# Altium schematic sheet SIGNAL BLOCK DIAGRAM.SchDoc
size A1
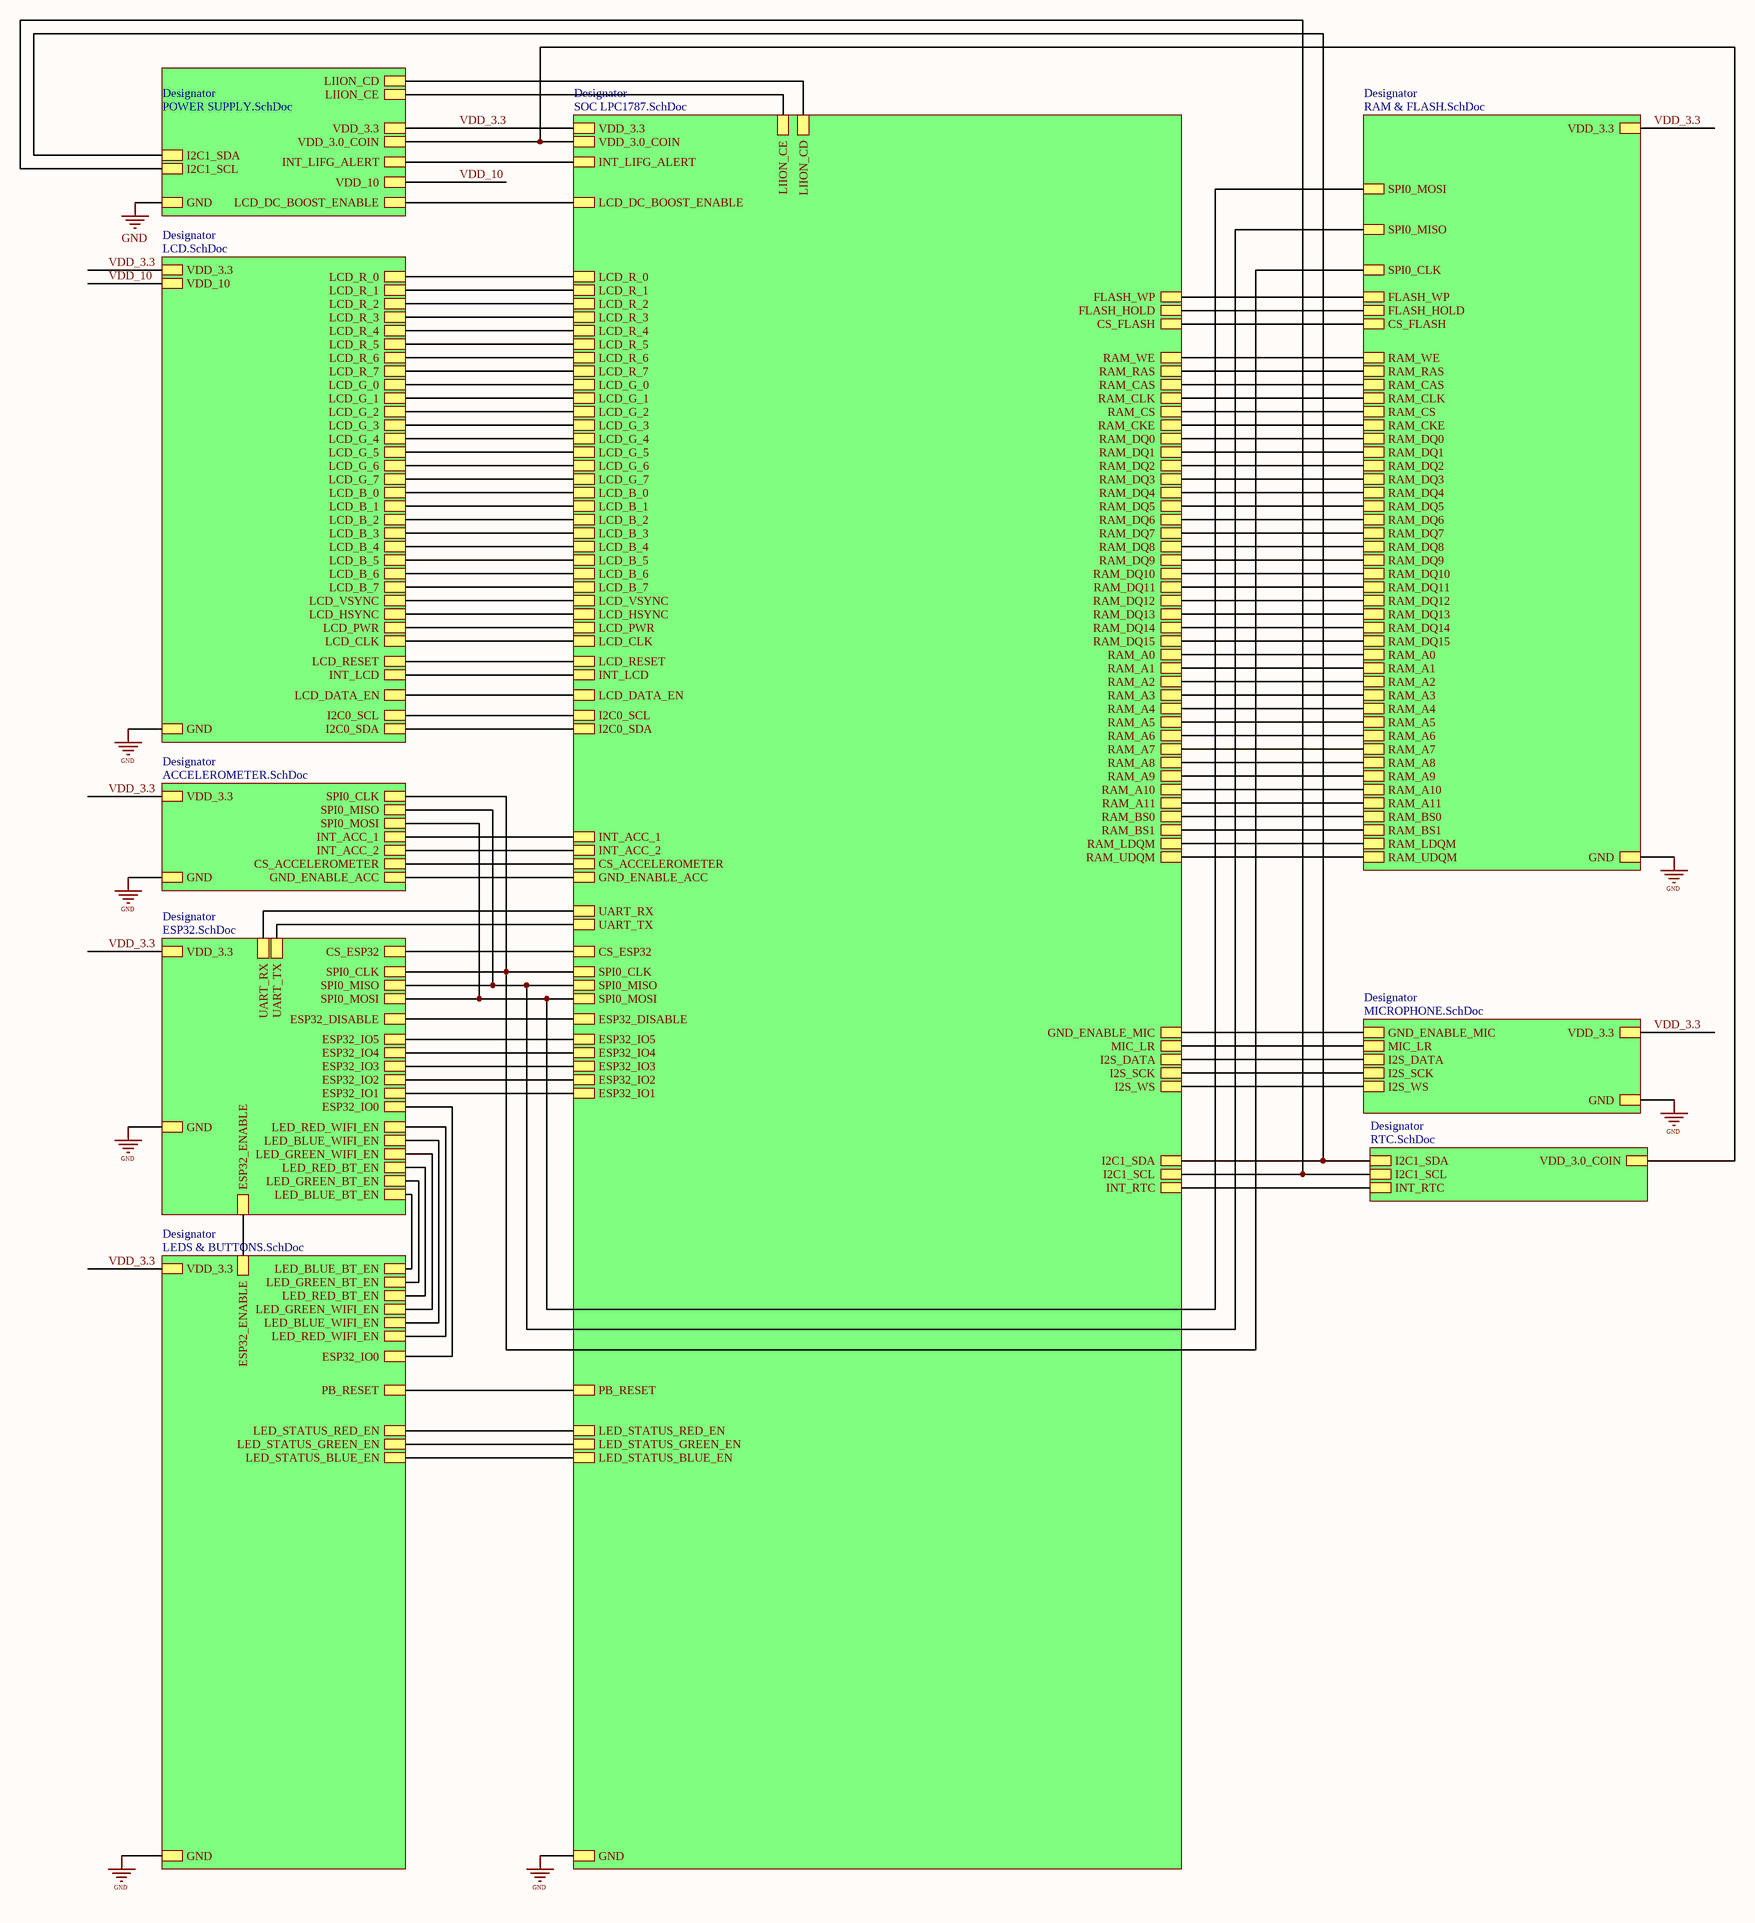
[diagram p0: SIGNAL BLOCK DIAGRAM.SchDoc]

## Sub-sheets
Designator = ACCELEROMETER.SchDoc: INT_ACC_1, GND_ENABLE_ACC, INT_ACC_2, VDD_3.3, CS_ACCELEROMETER, GND, SPI0_MISO, SPI0_CLK, SPI0_MOSI
Designator = SOC LPC1787.SchDoc: LCD_DC_BOOST_ENABLE, MIC_LR, LCD_R_2, PB_RESET, LCD_R_3, CS_FLASH, LCD_G_6, LCD_R_5, I2C1_SDA, LCD_G_0, LCD_R_0, LCD_B_2, LCD_B_1, LCD_G_2, LCD_R_1, LCD_CLK, LCD_B_4, LCD_G_4, LCD_G_5, I2C1_SCL, LCD_G_1, LCD_B_3, LCD_R_6, LCD_R_7, INT_LCD, LCD_RESET, LCD_B_0, I2C0_SDA, LCD_R_4, LCD_G_7, INT_ACC_2, INT_ACC_1, ESP32_DISABLE, LCD_G_3, CS_ESP32, CS_ACCELEROMETER, INT_RTC, VDD_3.3, GND, I2C0_SCL, LCD_DATA_EN, LCD_HSYNC, LCD_VSYNC, LCD_B_7, LCD_B_6, LCD_B_5, GND_ENABLE_ACC, LED_STATUS_GREEN_EN, LED_STATUS_RED_EN, VDD_3.0_COIN, GND_ENABLE_MIC, LED_STATUS_BLUE_EN, I2S_DATA, I2S_SCK, I2S_WS, ESP32_IO1, ESP32_IO2, ESP32_IO3, ESP32_IO4, SPI0_CLK, SPI0_MISO, SPI0_MOSI, FLASH_HOLD, FLASH_WP, LIION_CD, LIION_CE, LCD_PWR, RAM_WE, RAM_RAS, RAM_CAS, RAM_CLK, RAM_CS, RAM_CKE, RAM_DQ0, RAM_DQ1, RAM_DQ2, RAM_DQ3, RAM_DQ4, RAM_DQ5, RAM_DQ6, RAM_DQ7, RAM_DQ8, RAM_DQ9, RAM_DQ10, RAM_DQ11, RAM_DQ12, RAM_DQ13, RAM_DQ14, RAM_DQ15, RAM_A0, RAM_A1, RAM_A2, RAM_A3, RAM_A4, RAM_A5, RAM_A6, RAM_A7, RAM_A8, RAM_A9, RAM_A10, RAM_A11, RAM_BS0, RAM_BS1, RAM_LDQM, RAM_UDQM, INT_LIFG_ALERT, ESP32_IO5, UART_RX, UART_TX
Designator = LEDS & BUTTONS.SchDoc: VDD_3.3, LED_RED_BT_EN, LED_BLUE_BT_EN, LED_GREEN_BT_EN, PB_RESET, LED_RED_WIFI_EN, LED_GREEN_WIFI_EN, LED_BLUE_WIFI_EN, ESP32_IO0, ESP32_ENABLE, LED_STATUS_RED_EN, LED_STATUS_GREEN_EN, GND, LED_STATUS_BLUE_EN
Designator = RTC.SchDoc: I2C1_SDA, VDD_3.0_COIN, I2C1_SCL, INT_RTC
Designator = POWER SUPPLY.SchDoc: VDD_3.0_COIN, VDD_10, VDD_3.3, LCD_DC_BOOST_ENABLE, GND, I2C1_SDA, I2C1_SCL, LIION_CD, LIION_CE, INT_LIFG_ALERT
Designator = MICROPHONE.SchDoc: VDD_3.3, MIC_LR, GND, GND_ENABLE_MIC, I2S_WS, I2S_DATA, I2S_SCK
Designator = RAM & FLASH.SchDoc: VDD_3.3, CS_FLASH, GND, SPI0_MOSI, FLASH_HOLD, SPI0_MISO, SPI0_CLK, FLASH_WP, RAM_RAS, RAM_DQ9, RAM_WE, RAM_LDQM, RAM_CAS, RAM_DQ0, RAM_DQ1, RAM_DQ2, RAM_DQ3, RAM_CS, RAM_DQ13, RAM_DQ4, RAM_DQ15, RAM_A11, RAM_A0, RAM_A2, RAM_A3, RAM_A4, RAM_A5, RAM_A6, RAM_A7, RAM_A8, RAM_A9, RAM_DQ14, RAM_DQ10, RAM_DQ8, RAM_DQ5, RAM_DQ11, RAM_DQ6, RAM_DQ12, RAM_DQ7, RAM_A10, RAM_A1, RAM_BS1, RAM_CKE, RAM_BS0, RAM_CLK, RAM_UDQM
Designator = ESP32.SchDoc: ESP32_IO0, LED_BLUE_WIFI_EN, LED_RED_BT_EN, ESP32_DISABLE, LED_BLUE_BT_EN, LED_RED_WIFI_EN, CS_ESP32, VDD_3.3, LED_GREEN_WIFI_EN, GND, LED_GREEN_BT_EN, SPI0_MISO, SPI0_MOSI, ESP32_IO4, ESP32_IO2, SPI0_CLK, ESP32_IO1, ESP32_IO3, ESP32_IO5, UART_RX, UART_TX, ESP32_ENABLE
Designator = LCD.SchDoc: LCD_G_6, LCD_B_1, LCD_B_2, LCD_B_3, LCD_B_4, LCD_B_5, LCD_R_5, LCD_B_6, LCD_HSYNC, LCD_VSYNC, LCD_B_0, LCD_G_7, LCD_R_6, LCD_G_4, LCD_R_3, LCD_B_7, I2C0_SCL, LCD_G_0, LCD_G_5, INT_LCD, VDD_3.3, LCD_DATA_EN, LCD_R_0, LCD_R_1, LCD_R_2, LCD_RESET, I2C0_SDA, LCD_CLK, LCD_G_3, VDD_10, LCD_R_7, LCD_G_2, LCD_R_4, LCD_G_1, GND, LCD_PWR

## Nets
GND: sheet Designator/GND, sheet Designator/GND, sheet Designator/GND, sheet Designator/GND, sheet Designator/GND, sheet Designator/GND, sheet Designator/GND, sheet Designator/GND
VDD_3.3: sheet Designator/VDD_3.3, sheet Designator/VDD_3.3, sheet Designator/VDD_3.3, sheet Designator/VDD_3.3, sheet Designator/VDD_3.3, sheet Designator/VDD_3.3, sheet Designator/VDD_3.3, sheet Designator/VDD_3.3
VDD_10: sheet Designator/VDD_10, sheet Designator/VDD_10
(unnamed): sheet Designator/INT_ACC_1, sheet Designator/INT_ACC_1
(unnamed): sheet Designator/GND_ENABLE_ACC, sheet Designator/GND_ENABLE_ACC
(unnamed): sheet Designator/INT_ACC_2, sheet Designator/INT_ACC_2
(unnamed): sheet Designator/CS_ACCELEROMETER, sheet Designator/CS_ACCELEROMETER
(unnamed): sheet Designator/SPI0_MISO, sheet Designator/SPI0_MISO, sheet Designator/SPI0_MISO, sheet Designator/SPI0_MISO
(unnamed): sheet Designator/SPI0_CLK, sheet Designator/SPI0_CLK, sheet Designator/SPI0_CLK, sheet Designator/SPI0_CLK
(unnamed): sheet Designator/SPI0_MOSI, sheet Designator/SPI0_MOSI, sheet Designator/SPI0_MOSI, sheet Designator/SPI0_MOSI
(unnamed): sheet Designator/LCD_DC_BOOST_ENABLE, sheet Designator/LCD_DC_BOOST_ENABLE
(unnamed): sheet Designator/MIC_LR, sheet Designator/MIC_LR
(unnamed): sheet Designator/LCD_R_2, sheet Designator/LCD_R_2
(unnamed): sheet Designator/PB_RESET, sheet Designator/PB_RESET
(unnamed): sheet Designator/LCD_R_3, sheet Designator/LCD_R_3
(unnamed): sheet Designator/CS_FLASH, sheet Designator/CS_FLASH
(unnamed): sheet Designator/LCD_G_6, sheet Designator/LCD_G_6
(unnamed): sheet Designator/LCD_R_5, sheet Designator/LCD_R_5
(unnamed): sheet Designator/I2C1_SDA, sheet Designator/I2C1_SDA, sheet Designator/I2C1_SDA
(unnamed): sheet Designator/LCD_G_0, sheet Designator/LCD_G_0
(unnamed): sheet Designator/LCD_R_0, sheet Designator/LCD_R_0
(unnamed): sheet Designator/LCD_B_2, sheet Designator/LCD_B_2
(unnamed): sheet Designator/LCD_B_1, sheet Designator/LCD_B_1
(unnamed): sheet Designator/LCD_G_2, sheet Designator/LCD_G_2
(unnamed): sheet Designator/LCD_R_1, sheet Designator/LCD_R_1
(unnamed): sheet Designator/LCD_CLK, sheet Designator/LCD_CLK
(unnamed): sheet Designator/LCD_B_4, sheet Designator/LCD_B_4
(unnamed): sheet Designator/LCD_G_4, sheet Designator/LCD_G_4
(unnamed): sheet Designator/LCD_G_5, sheet Designator/LCD_G_5
(unnamed): sheet Designator/I2C1_SCL, sheet Designator/I2C1_SCL, sheet Designator/I2C1_SCL
(unnamed): sheet Designator/LCD_G_1, sheet Designator/LCD_G_1
(unnamed): sheet Designator/LCD_B_3, sheet Designator/LCD_B_3
(unnamed): sheet Designator/LCD_R_6, sheet Designator/LCD_R_6
(unnamed): sheet Designator/LCD_R_7, sheet Designator/LCD_R_7
(unnamed): sheet Designator/INT_LCD, sheet Designator/INT_LCD
(unnamed): sheet Designator/LCD_RESET, sheet Designator/LCD_RESET
(unnamed): sheet Designator/LCD_B_0, sheet Designator/LCD_B_0
(unnamed): sheet Designator/I2C0_SDA, sheet Designator/I2C0_SDA
(unnamed): sheet Designator/LCD_R_4, sheet Designator/LCD_R_4
(unnamed): sheet Designator/LCD_G_7, sheet Designator/LCD_G_7
(unnamed): sheet Designator/ESP32_DISABLE, sheet Designator/ESP32_DISABLE
(unnamed): sheet Designator/LCD_G_3, sheet Designator/LCD_G_3
(unnamed): sheet Designator/CS_ESP32, sheet Designator/CS_ESP32
(unnamed): sheet Designator/INT_RTC, sheet Designator/INT_RTC
(unnamed): sheet Designator/I2C0_SCL, sheet Designator/I2C0_SCL
(unnamed): sheet Designator/LCD_DATA_EN, sheet Designator/LCD_DATA_EN
(unnamed): sheet Designator/LCD_HSYNC, sheet Designator/LCD_HSYNC
(unnamed): sheet Designator/LCD_VSYNC, sheet Designator/LCD_VSYNC
(unnamed): sheet Designator/LCD_B_7, sheet Designator/LCD_B_7
(unnamed): sheet Designator/LCD_B_6, sheet Designator/LCD_B_6
(unnamed): sheet Designator/LCD_B_5, sheet Designator/LCD_B_5
(unnamed): sheet Designator/LED_STATUS_GREEN_EN, sheet Designator/LED_STATUS_GREEN_EN
(unnamed): sheet Designator/LED_STATUS_RED_EN, sheet Designator/LED_STATUS_RED_EN
(unnamed): sheet Designator/VDD_3.0_COIN, sheet Designator/VDD_3.0_COIN, sheet Designator/VDD_3.0_COIN
(unnamed): sheet Designator/GND_ENABLE_MIC, sheet Designator/GND_ENABLE_MIC
(unnamed): sheet Designator/LED_STATUS_BLUE_EN, sheet Designator/LED_STATUS_BLUE_EN
(unnamed): sheet Designator/I2S_DATA, sheet Designator/I2S_DATA
(unnamed): sheet Designator/I2S_SCK, sheet Designator/I2S_SCK
(unnamed): sheet Designator/I2S_WS, sheet Designator/I2S_WS
(unnamed): sheet Designator/ESP32_IO1, sheet Designator/ESP32_IO1
(unnamed): sheet Designator/ESP32_IO2, sheet Designator/ESP32_IO2
(unnamed): sheet Designator/ESP32_IO3, sheet Designator/ESP32_IO3
(unnamed): sheet Designator/ESP32_IO4, sheet Designator/ESP32_IO4
(unnamed): sheet Designator/FLASH_HOLD, sheet Designator/FLASH_HOLD
(unnamed): sheet Designator/FLASH_WP, sheet Designator/FLASH_WP
(unnamed): sheet Designator/LIION_CD, sheet Designator/LIION_CD
(unnamed): sheet Designator/LIION_CE, sheet Designator/LIION_CE
(unnamed): sheet Designator/LCD_PWR, sheet Designator/LCD_PWR
(unnamed): sheet Designator/RAM_WE, sheet Designator/RAM_WE
(unnamed): sheet Designator/RAM_RAS, sheet Designator/RAM_RAS
(unnamed): sheet Designator/RAM_CAS, sheet Designator/RAM_CAS
(unnamed): sheet Designator/RAM_CLK, sheet Designator/RAM_CLK
(unnamed): sheet Designator/RAM_CS, sheet Designator/RAM_CS
(unnamed): sheet Designator/RAM_CKE, sheet Designator/RAM_CKE
(unnamed): sheet Designator/RAM_DQ0, sheet Designator/RAM_DQ0
(unnamed): sheet Designator/RAM_DQ1, sheet Designator/RAM_DQ1
(unnamed): sheet Designator/RAM_DQ2, sheet Designator/RAM_DQ2
(unnamed): sheet Designator/RAM_DQ3, sheet Designator/RAM_DQ3
(unnamed): sheet Designator/RAM_DQ4, sheet Designator/RAM_DQ4
(unnamed): sheet Designator/RAM_DQ5, sheet Designator/RAM_DQ5
(unnamed): sheet Designator/RAM_DQ6, sheet Designator/RAM_DQ6
(unnamed): sheet Designator/RAM_DQ7, sheet Designator/RAM_DQ7
(unnamed): sheet Designator/RAM_DQ8, sheet Designator/RAM_DQ8
(unnamed): sheet Designator/RAM_DQ9, sheet Designator/RAM_DQ9
(unnamed): sheet Designator/RAM_DQ10, sheet Designator/RAM_DQ10
(unnamed): sheet Designator/RAM_DQ11, sheet Designator/RAM_DQ11
(unnamed): sheet Designator/RAM_DQ12, sheet Designator/RAM_DQ12
(unnamed): sheet Designator/RAM_DQ13, sheet Designator/RAM_DQ13
(unnamed): sheet Designator/RAM_DQ14, sheet Designator/RAM_DQ14
(unnamed): sheet Designator/RAM_DQ15, sheet Designator/RAM_DQ15
(unnamed): sheet Designator/RAM_A0, sheet Designator/RAM_A0
(unnamed): sheet Designator/RAM_A1, sheet Designator/RAM_A1
(unnamed): sheet Designator/RAM_A2, sheet Designator/RAM_A2
(unnamed): sheet Designator/RAM_A3, sheet Designator/RAM_A3
(unnamed): sheet Designator/RAM_A4, sheet Designator/RAM_A4
(unnamed): sheet Designator/RAM_A5, sheet Designator/RAM_A5
(unnamed): sheet Designator/RAM_A6, sheet Designator/RAM_A6
(unnamed): sheet Designator/RAM_A7, sheet Designator/RAM_A7
(unnamed): sheet Designator/RAM_A8, sheet Designator/RAM_A8
(unnamed): sheet Designator/RAM_A9, sheet Designator/RAM_A9
(unnamed): sheet Designator/RAM_A10, sheet Designator/RAM_A10
(unnamed): sheet Designator/RAM_A11, sheet Designator/RAM_A11
(unnamed): sheet Designator/RAM_BS0, sheet Designator/RAM_BS0
(unnamed): sheet Designator/RAM_BS1, sheet Designator/RAM_BS1
(unnamed): sheet Designator/RAM_LDQM, sheet Designator/RAM_LDQM
(unnamed): sheet Designator/RAM_UDQM, sheet Designator/RAM_UDQM
(unnamed): sheet Designator/INT_LIFG_ALERT, sheet Designator/INT_LIFG_ALERT
(unnamed): sheet Designator/ESP32_IO5, sheet Designator/ESP32_IO5
(unnamed): sheet Designator/UART_RX, sheet Designator/UART_RX
(unnamed): sheet Designator/UART_TX, sheet Designator/UART_TX
(unnamed): sheet Designator/LED_RED_BT_EN, sheet Designator/LED_RED_BT_EN
(unnamed): sheet Designator/LED_BLUE_BT_EN, sheet Designator/LED_BLUE_BT_EN
(unnamed): sheet Designator/LED_GREEN_BT_EN, sheet Designator/LED_GREEN_BT_EN
(unnamed): sheet Designator/LED_RED_WIFI_EN, sheet Designator/LED_RED_WIFI_EN
(unnamed): sheet Designator/LED_GREEN_WIFI_EN, sheet Designator/LED_GREEN_WIFI_EN
(unnamed): sheet Designator/LED_BLUE_WIFI_EN, sheet Designator/LED_BLUE_WIFI_EN
(unnamed): sheet Designator/ESP32_IO0, sheet Designator/ESP32_IO0
(unnamed): sheet Designator/ESP32_ENABLE, sheet Designator/ESP32_ENABLE